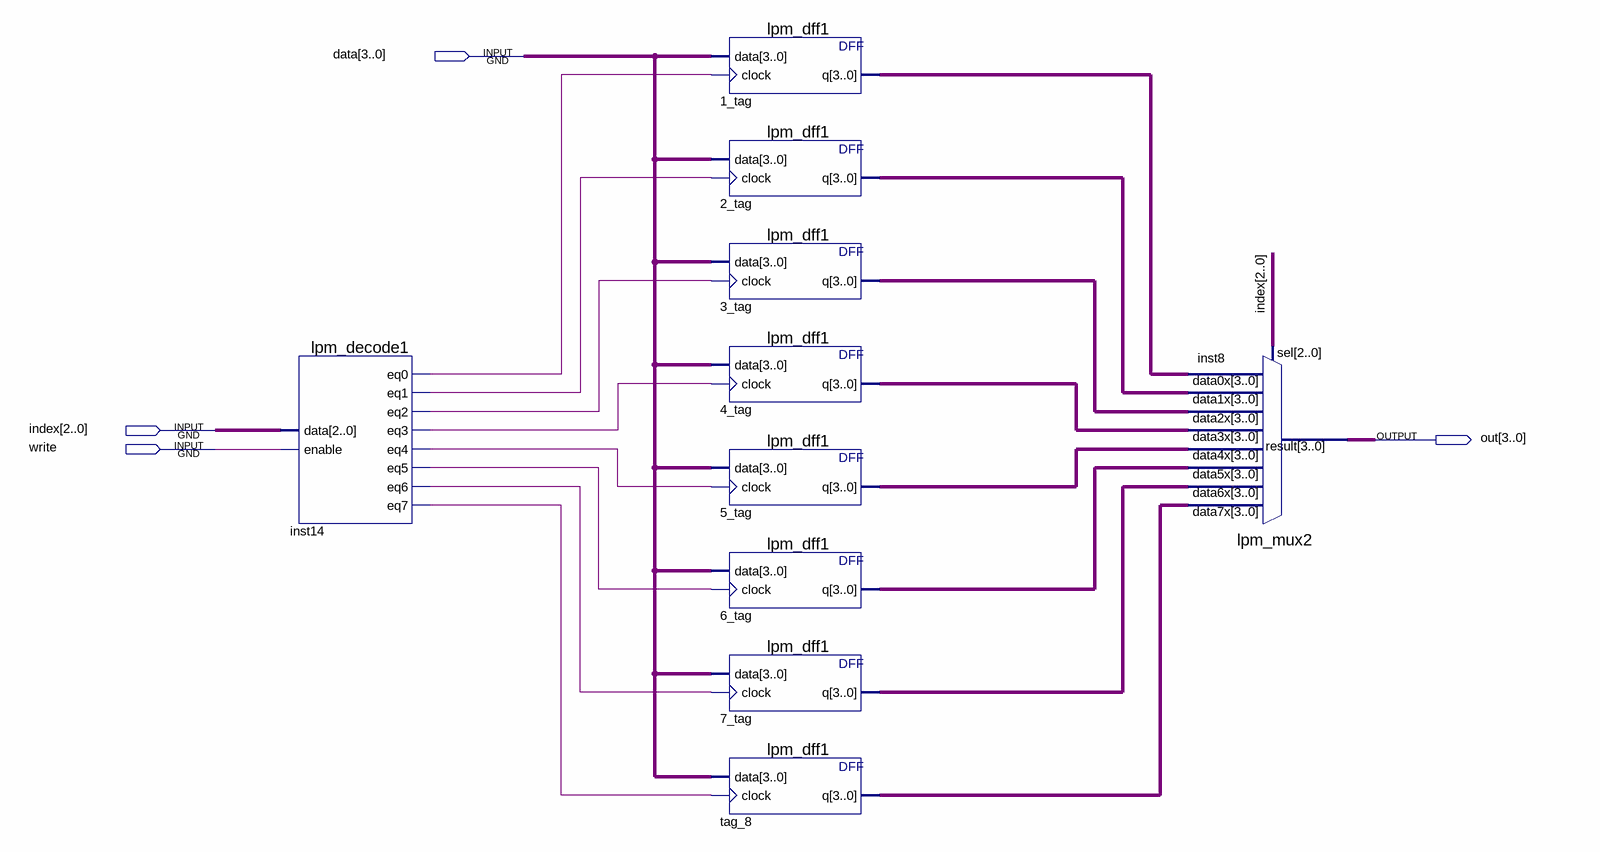
[diagram p0: schematic sheet]
// Quartus schematic tag_ram.bdf as structural Verilog: 10 symbols, 4 pins
module tag_ram (
  input  [3:0] data,
  input  [2:0] index,
  input  write,
  output [3:0] out
);

  wire inst14_eq0, inst14_eq1, inst14_eq2, inst14_eq3, inst14_eq4, inst14_eq5, inst14_eq6, inst14_eq7;
  wire [3:0] n1_tag_q, n2_tag_q, n3_tag_q, n4_tag_q, n5_tag_q, n6_tag_q, n7_tag_q, tag_8_q;

  lpm_decode1 inst14 (
    .data(index), .enable(write), .eq0(inst14_eq0), .eq1(inst14_eq1), .eq2(inst14_eq2), .eq3(inst14_eq3),
    .eq4(inst14_eq4), .eq5(inst14_eq5), .eq6(inst14_eq6), .eq7(inst14_eq7));
  lpm_dff1 u_1_tag (.data(data), .clock(inst14_eq0), .q(n1_tag_q));
  lpm_dff1 u_2_tag (.data(data), .clock(inst14_eq1), .q(n2_tag_q));
  lpm_dff1 u_3_tag (.data(data), .clock(inst14_eq2), .q(n3_tag_q));
  lpm_dff1 u_4_tag (.data(data), .clock(inst14_eq3), .q(n4_tag_q));
  lpm_dff1 u_5_tag (.data(data), .clock(inst14_eq4), .q(n5_tag_q));
  lpm_dff1 u_6_tag (.data(data), .clock(inst14_eq5), .q(n6_tag_q));
  lpm_dff1 u_7_tag (.data(data), .clock(inst14_eq6), .q(n7_tag_q));
  lpm_dff1 tag_8 (.data(data), .clock(inst14_eq7), .q(tag_8_q));
  lpm_mux2 inst8 (
    .data7x(tag_8_q), .data6x(n7_tag_q), .data5x(n6_tag_q), .data4x(n5_tag_q), .data3x(n4_tag_q),
    .data2x(n3_tag_q), .data1x(n2_tag_q), .data0x(n1_tag_q), .sel(index), .result(out));
endmodule
